# Altium schematic sheet GroundStation.SchDoc
size A4
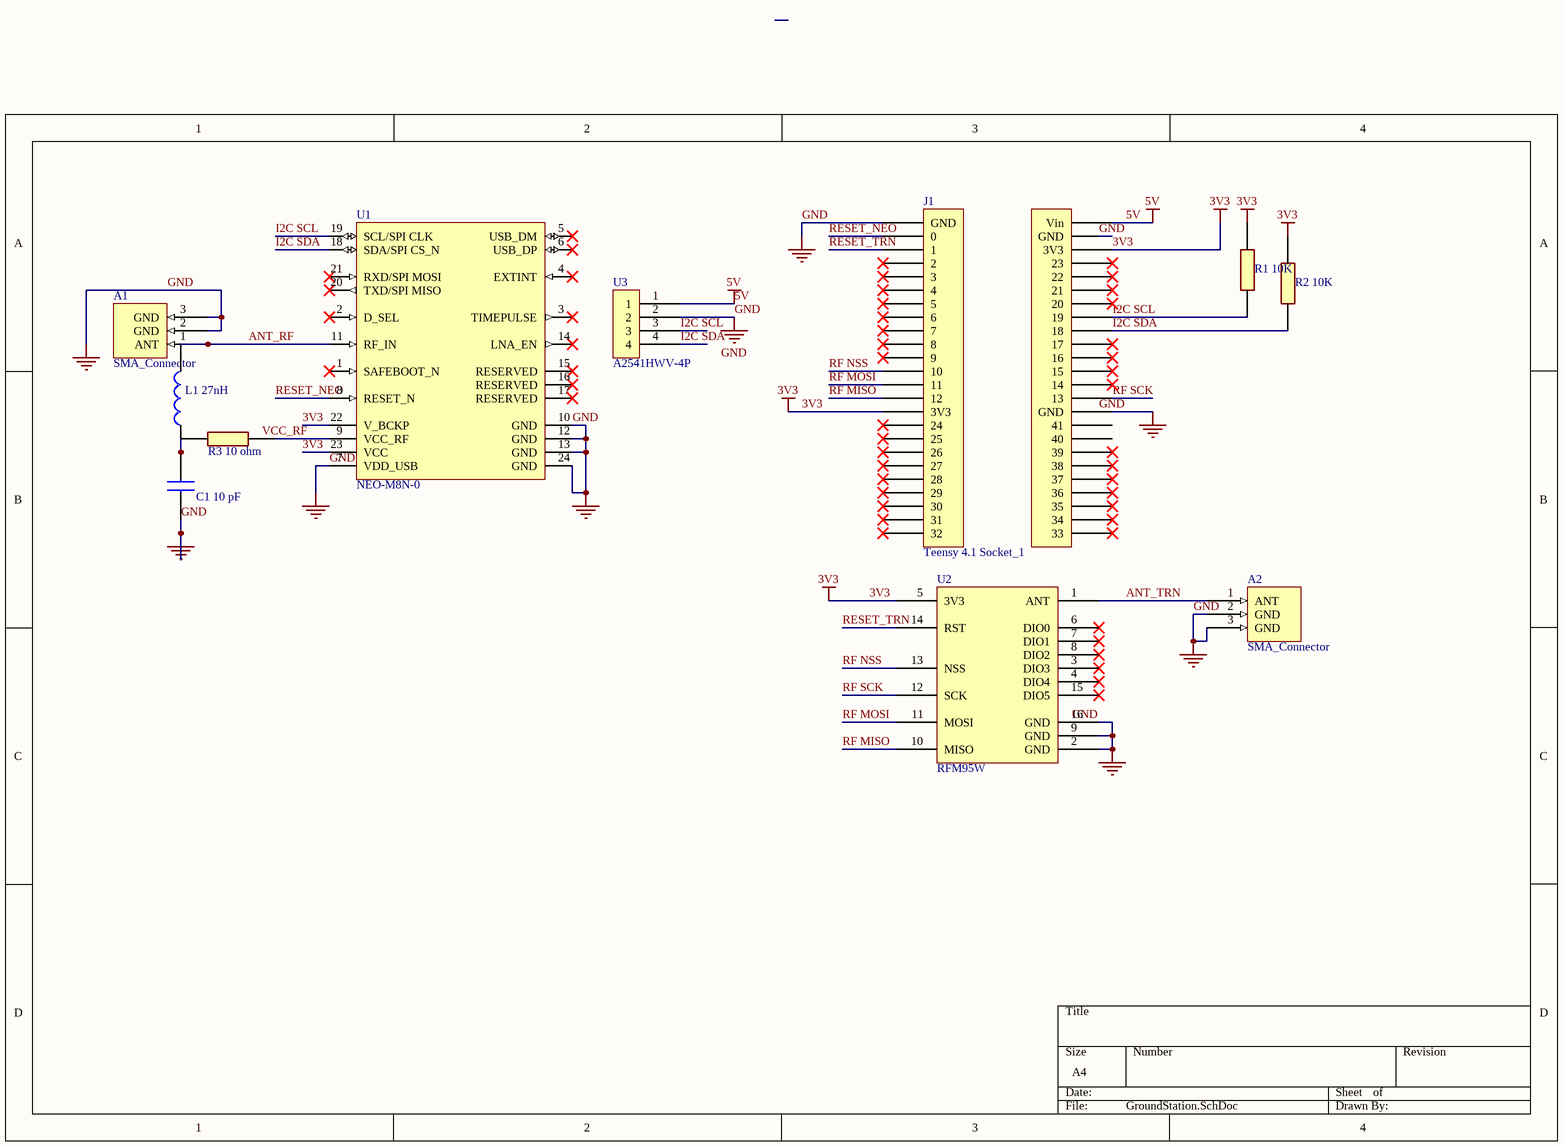
[diagram p0: GroundStation.SchDoc]

## Parts
A1  SMA_Connector  [SMA Connector]
A2  SMA_Connector  [SMA Connector]
C1_10_pF  CL21B103KBANNNC  [CAPC2012X75N]  (value not drawn)
J1  Teensy 4.1 Socket_1  [Teensy 4.1 Socket]
L1_27nH  LQG15HS27NJ02D  [LQG15WH0N7B02D]  (value not drawn)
R1_10K  0402WGF1002TCE  [RESC1005X40N]  (value not drawn)
R2_10K  0402WGF1002TCE  [RESC1005X40N]  (value not drawn)
R3_10_ohm  0402WGF100JTCE  [RESC1005X40N]  (value not drawn)
U1  NEO-M8N-0  [UBX-NEO-M8-24_V]
U2  RFM95W  [RFM95CW]
U3  A2541HWV-4P  [A2541HWV-4P]

## Nets
3V3: J1.22(3V3) J1.34(3V3) R1_10K.2 R2_10K.2 U1.22(V_BCKP) U1.23(VCC) U2.5(3V3)
5V: J1.24(Vin) U3.1
GND: A1.2(GND) A1.3(GND) A2.2(GND) A2.3(GND) C1_10_pF.1 J1.10(GND) J1.23(GND) J1.48(GND) U1.7(VDD_USB) U1.10(GND) U1.12(GND) U1.13(GND) U1.24(GND) U2.2(GND) U2.9(GND) U2.16(GND) U3.2
ANT_RF: A1.1(ANT) L1_27nH.2 U1.11(RF_IN)
ANT_TRN: A2.1(ANT) U2.1(ANT)
I2C SCL: J1.17(19) R1_10K.1 U1.19(SCL/SPI_CLK) U3.3
I2C SDA: J1.16(18) R2_10K.1 U1.18(SDA/SPI_CS_N) U3.4
RESET_NEO: J1.47(0) U1.8(RESET_N)
RESET_TRN: J1.46(1) U2.14(RST)
RF MISO: J1.35(12) U2.10(MISO)
RF MOSI: J1.36(11) U2.11(MOSI)
RF NSS: J1.37(10) U2.13(NSS)
RF SCK: J1.11(13) U2.12(SCK)
NetC1_10_pF_2: C1_10_pF.2 L1_27nH.1 R3_10_ohm.1
NetR3_10_ohm_2: R3_10_ohm.2 U1.9(VCC_RF)

Not connected (* = marked no-connect by the designer): J1 1(33)* 2(34)* 3(35)* 4(36)* 5(37)* 6(38)* 7(39)* 8(40) 9(41) 12(14)* 13(15)* 14(16)* 15(17)* 18(20)* 19(21)* 20(22)* 21(23)* 25(32)* 26(31)* 27(30)* 28(29)* 29(28)* 30(27)* 31(26)* 32(25)* 33(24)* 38(9)* 39(8)* 40(7)* 41(6)* 42(5)* 43(4)* 44(3)* 45(2)*; U1 1(SAFEBOOT_N)* 2(D_SEL)* 3(TIMEPULSE)* 4(EXTINT)* 5(USB_DM)* 6(USB_DP)* 14(LNA_EN)* 15(RESERVED)* 16(RESERVED)* 17(RESERVED)* 20(TXD/SPI_MISO)* 21(RXD/SPI_MOSI)*; U2 3(DIO3)* 4(DIO4)* 6(DIO0)* 7(DIO1)* 8(DIO2)* 15(DIO5)*

## Notes on the sheet
- Labels drawn without touching a wire or pin: GND, VCC_RF

## Library data of the parts
A1 A2 = CMP-003-000004-2: SMA Connector Side Board Connection Female Socket 50 ohms; Source: SMA_Connector.SchLib; Design Item ID: Component_1
C1_10_pF = CMP-001-00086-1: Samsung Electro-Mechanics 0805 CL 10nF Ceramic Multilayer Capacitor, 50 V, +125C, X7R Dielectric, +/-10% SMD; Geometry.Height: 0.75mm; Datasheet Link: https://datasheet.datasheetarchive.com/originals/distributors/Datasheets_SAMA/97c54fb7f716f6f5bd35dfc2c9b17795.pdf; Design Item ID: CL21B103KBANNNC; Source: CL21B103KBANNNC.SchLib; Mouser Price/Stock: https://www.mouser.co.uk/ProductDetail/Samsung-Electro-Mechanics/CL21B103KBANNNC?qs=349EhDEZ59oTK9iJ%2FqCMuw%3D%3D; Arrow Part Number: CL21B103KBANNNC; Manufacturer_Name: SAMSUNG; Mouser Part Number: 187-CL21B103KBANNNC; Manufacturer_Part_Number: CL21B103KBANNNC; Arrow Price/Stock: https://www.arrow.com/en/products/cl21b103kbannnc/samsung-electro-mechanics?utm_currency=USD&region=europe
J1 = CMP-002-00071-1: 2x 24POS, 2.54mm pitch header pins for socketing a Teensy 4.1; Design Item ID: Teensy 4.1 Socket_1; Source: Teensy 4.1 Socket.SchLib
L1_27nH = CMP-006-00021-1: Inductor SMD 0402 27nH 300mA Murata LQG15HS Series Wire-wound SMD Inductor 27 nH +/-5% Wire-Wound 300mA Idc Q:8; Manufacturer_Name: Murata Electronics; Geometry.Height: 0.55mm; Arrow Part Number: LQG15HS27NJ02D; Datasheet Link: https://psearch.en.murata.com/inductor/product/LQG15HS27NJ02%23.html; Mouser Price/Stock: https://www.mouser.co.uk/ProductDetail/Murata-Electronics/LQG15HS27NJ02D?qs=ctz47l0uL1AbPpSO0oLF1A%3D%3D; Arrow Price/Stock: https://www.arrow.com/en/products/lqg15hs27nj02d/murata-manufacturing?region=nac; Design Item ID: LQG15HS27NJ02D; Source: LQG15HS27NJ02D.SchLib; Mouser Part Number: 81-LQG15HS27NJ02D; Manufacturer_Part_Number: LQG15HS27NJ02D
R1_10K R2_10K = CMP-009-00184-1: Chip Resistor - Surface Mount 10KOhms +/-1% 1/16W 0402 RoHS; Manufacturer_Name: UNI-ROYAL(Uniroyal Elec); Geometry.Height: 0.4mm; Design Item ID: 0402WGF1002TCE; Datasheet Link: https://datasheet.lcsc.com/szlcsc/Uniroyal-Elec-0402WGF1002TCE_C25744.pdf; Mouser Part Number: *; Manufacturer_Part_Number: 0402WGF1002TCE; Source: 0402WGF1002TCE.SchLib; Arrow Price/Stock: *; Mouser Price/Stock: *; Arrow Part Number: *
R3_10_ohm = CMP-009-00183-1: Chip Resistor - Surface Mount 10Ohms +/-1% 1/16W 0402 RoHS; Manufacturer_Name: UNI-ROYAL(Uniroyal Elec); Geometry.Height: 0.4mm; Arrow Price/Stock: *; Mouser Price/Stock: *; Source: 0402WGF100JTCE.SchLib; Mouser Part Number: *; Arrow Part Number: *; Datasheet Link: https://datasheet.lcsc.com/lcsc/2205311900_UNI-ROYAL-Uniroyal-Elec-0402WGF100JTCE_C25077.pdf; Design Item ID: 0402WGF100JTCE; Manufacturer_Part_Number: 0402WGF100JTCE
U1 = CMP-2000-07559-1: U-Blox M8 Concurrent Gnss Module, 3.6 V, -40 to 85 degC, 24-Pin SMD, RoHS, Tape and Reel; Mounting Technology: SurfaceMount; Manufacturer: U-Blox; Manufacturer URL: https://www.u-blox.com/en; Package Reference: NEO-M8N-0; Datasheet Version: Rev. R03, 08/2016; RoHSCompliant: False; Package URL: https://www.u-blox.com/sites/default/files/NEO-8Q-NEO-M8-FW3_HardwareIntegrationManual_%28UBX-15029985%29.pdf; Datasheet URL: https://www.u-blox.com/sites/default/files/NEO-M8-FW3_DataSheet_%28UBX-15031086%29.pdf; Package Description: 24-Pin Surface Mount Device, Body 16 x 12.2 mm, Pitch 1.1 mm
U2 = CMP-005-000004-2: LoRa Transceiver module 137-1020 MHz; Source: RFM95CW.SchLib; Design Item ID: RFM95W
U3 = CMP-085-000001-3: 1x4Pin connector throughhole, square holes; Source: A2541HWV-4P.SchLib; Design Item ID: A2541HWV-4P